# Altium schematic sheet PG09_ TEMP_BALANCER.SchDoc: BMU - Thermistor Monitors
size B; Address1: 3511 EDISON WAY; Address2: MENLO PARK, CA, 94025; DocumentNumber: 1; Revision: 4.1; SheetNumber: 4; SheetTotal: 9
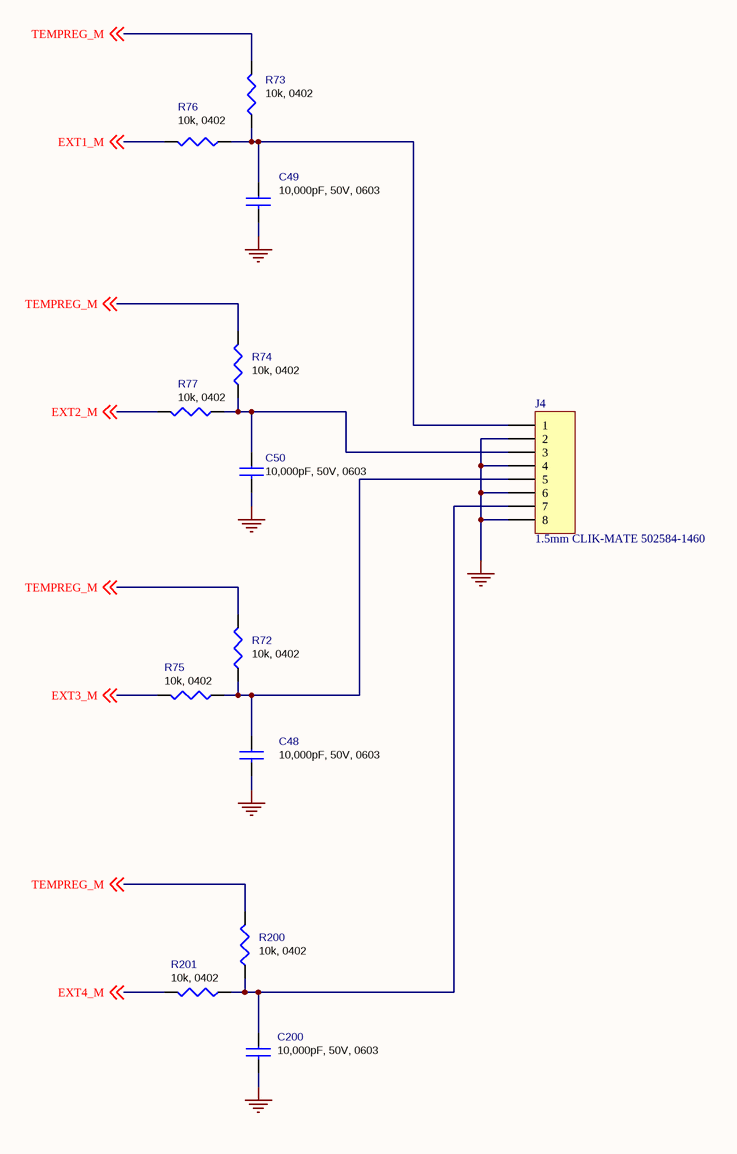
[diagram p0: PG09_ TEMP_BALANCER.SchDoc]

## Parts
C48  10,000pF, 50V, 0603  [C0603]
C49  10,000pF, 50V, 0603  [C0603]
C50  10,000pF, 50V, 0603  [C0603]
C200  10,000pF, 50V, 0603  [C0603]
J4  1.5mm CLIK-MATE 502584-1460  [CONN8_1P5MM_SM]
R72  10k, 0402  [R0402]
R73  10k, 0402  [R0402]
R74  10k, 0402  [R0402]
R75  10k, 0402  [R0402]
R76  10k, 0402  [R0402]
R77  10k, 0402  [R0402]
R200  10k, 0402  [R0402]
R201  10k, 0402  [R0402]

## Nets
GND: C48.2 C49.2 C50.2 C200.2 J4.2 J4.4 J4.6 J4.8
EXT1_M: R76.2 ; off-sheet EXT1_M
EXT2_M: R77.2 ; off-sheet EXT2_M
EXT3_M: R75.2 ; off-sheet EXT3_M
EXT4_M: R201.2 ; off-sheet EXT4_M
TEMPREG_M: R72.2 R73.2 R74.2 R200.2 ; off-sheet TEMPREG_M
NetC48_1: C48.1 J4.5 R72.1 R75.1
NetC49_1: C49.1 J4.1 R73.1 R76.1
NetC50_1: C50.1 J4.3 R74.1 R77.1
NetC200_1: C200.1 J4.7 R200.1 R201.1

## Notes on the sheet
- Title
- Size:
- Date:
- B
- Number:
- Time:
- Revision:
- Sheet
- of
- MATTERNET
- 161 E. Evelyn Ave.
- Mountain View,
- CA 94041 USA
- PROPRIETRY & CONFIDENTIAL
  THE INFORMATION CONTAINS IN THIS DRAWING
  IS THE SOLE PROPERTY OF  MATTERNET Inc.
  ANY REPRODUCTION IN PART OR AS WHOLE
  WITHOUT A WRITTEN PERMISSION OF
  MATTERNET Inc. IS PROHIBITED
- File:

## Library data of the parts
C48-C50 C200 = CAP-Generic-0603: CAP CER 10000PF 50V X7R 0603; Manufacturer: TDK; Manufacturer Part Number: CGA3E2X7R1H103K080AE; Capacitance: 10nF; Tolerance: 10%; Supplier 1: Digi-Key; Supplier Part Number 1: 445-15955-1-ND; Stock 1: 42633; Pricing 1: 1=0.27, 10=0.186, 100=0.0944, 500=0.06458, 1000=0.05713 (USD); Mount: Surface Mount; Case/Package: 0603; Weight: 7.1E-05oz; Case Code (Metric): 1608; Case Code (Imperial): 0603; Min Operating Temperature: -55°C; Max Operating Temperature: 125°C; Package Quantity: 4000; Packaging: Tape and Reel; Voltage Rating: 50V; Dielectric: X7R; Termination: SMD/SMT; Voltage Rating (DC): 50V; Features: Soft Termination; Length: 0.063inch; Height: 0.8mm; Width: 0.031inch; Thickness: 0.035inch; Ratings: AEC-Q200
J4 = Header 8: CONN RCPT 8POS 0.059 TIN SMD; Manufacturer: Molex; Manufacturer Part Number: 502584-0860; Current Rating: 2A; Voltage Rating: 100V; Number of Positions: 8; Connector Type: Center Strip Contact,Receptacle; Gender: Female; Glow Wire Compliant: Non-compliant; Supplier 1: Digi-Key; Supplier Part Number 1: WM14465CT-ND; Stock 1: 1932; Pricing 1: 1=1.52, 10=1.382, 100=1.1846 (USD); Mount: Surface Mount; Color: Beige; Contact Plating: Tin; Housing Color: Beige; Housing Material: Thermoplastic; Contact Material: Copper Alloy; Min Operating Temperature: -25°C; Max Operating Temperature: 85°C; Contact Gender: Female; Package Quantity: 900; Number of Rows: 1; Packaging: Tape and Reel; Fastening Type: Latch; Termination: Solder; Number of Contacts: 8; Orientation: Vertical; Number of Circuits: 8; Length: 16.3mm; Pitch: 1.5mm; Depth: 6.35mm; Radiation Hardening: No; REACH SVHC: No SVHC; ComponentLink1URL: http://www.onlinecomponents.com/productFiles/mf-MOL/625135025840860_pcb_receptacles.pdf?src-supplier=Onlinecomponents.com; ComponentLink1Description: http://www.onlinecomponents.com/productFiles/mf-MOL/625135025840860_pcb_receptacles.pdf?src-supplier=Onlinecomponents.com; ComponentLink2URL: http://www.onlinecomponents.com/productFiles/mf-MOL/143515025840860_pcb_receptacles.pdf?src-supplier=Onlinecomponents.com; ComponentLink2Description: http://www.onlinecomponents.com/productFiles/mf-MOL/143515025840860_pcb_receptacles.pdf?src-supplier=Onlinecomponents.com; ComponentLink3URL: http://www.mouser.com/ds/2/276/5025840860_PCB_RECEPTACLES-179325.pdf?src-supplier=Mouser; ComponentLink3Description: http://www.mouser.com/ds/2/276/5025840860_PCB_RECEPTACLES-179325.pdf?src-supplier=Mouser; ComponentLink4URL: http://www.molex.com/webdocs/datasheets/pdf/en-us/5025840860_PCB_RECEPTACLES.pdf?src-supplier=Avnet; ComponentLink4Description: http://www.molex.com/webdocs/datasheets/pdf/en-us/5025840860_PCB_RECEPTACLES.pdf?src-supplier=Avnet; ComponentLink5URL: http://www.molex.com/pdm_docs/sd/5025840860_sd.pdf?src-supplier=Digi-Key; ComponentLink5Description: http://www.molex.com/pdm_docs/sd/5025840860_sd.pdf?src-supplier=Digi-Key
R72-R77 R200 R201 = R-Generic-0402: RES SMD 10K OHM 1% 1/16W 0402; Manufacturer: Vishay Dale; Manufacturer Part Number: CRCW040210K0FKTD; Resistance: 10kR; Power Rating: 63mW; Voltage Rating: 50V; Temperature Coefficient: 100ppm/°C; ComponentLink1URL: http://www.yageo.com/documents/recent/PYu-RC_Group_51_RoHS_L_9.pdf; ComponentLink1Description: http://www.yageo.com/documents/recent/PYu-RC_Group_51_RoHS_L_9.pdf; ComponentLink2URL: http://www.mouser.com/ds/2/447/PYu-RC0402_51_RoHS_L_6_r-8721.pdf; ComponentLink2Description: http://www.mouser.com/ds/2/447/PYu-RC0402_51_RoHS_L_6_r-8721.pdf; ComponentLink3URL: http://www.farnell.com/datasheets/1018594.pdf; ComponentLink3Description: http://www.farnell.com/datasheets/1018594.pdf; Supplier 1: Digi-Key; Supplier Part Number 1: 541-2955-1-ND; Stock 1: 17223; Pricing 1: 1=0.15, 10=0.132, 100=0.0508, 1000=0.02236, 2500=0.01931, 5000=0.01728 (USD); Mount: Surface Mount; Case/Package: 0402; Number of Pins: 2; Weight: 2.3E-05oz; Case Code (Metric): 1005; Case Code (Imperial): 0402; Contact Plating: Lead,Tin; Min Operating Temperature: -55°C; Max Operating Temperature: 155°C; Tolerance: 1%; Packaging: Tape and Reel; Package Quantity: 10000; Composition: Thick Film; Number of Terminations: 2; Military Standard: Not; Max Power Dissipation: 63mW; Voltage Rating (DC): 50V; Features: Automotive AEC-Q200; Length: 1mm; Height: 0.016inch; Width: 0.02inch; Depth: 0.5mm; Radiation Hardening: No; Lead Free: Contains Lead; REACH SVHC: Unknown; ComponentLink4URL: http://www.vishay.com/docs/20008/dcrcw.pdf?src-supplier=Digi-Key; ComponentLink4Description: http://www.vishay.com/docs/20008/dcrcw.pdf?src-supplier=Digi-Key; ComponentLink5URL: https://www.verical.com/server-webapp/html/getDatasheet?partID=104182&src-supplier=Verical; ComponentLink5Description: https://www.verical.com/server-webapp/html/getDatasheet?partID=104182&src-supplier=Verical; ComponentLink6URL: http://www.vishay.com/docs/20008/dcrcw.pdf?src-supplier=Avnet; ComponentLink6Description: http://www.vishay.com/docs/20008/dcrcw.pdf?src-supplier=Avnet